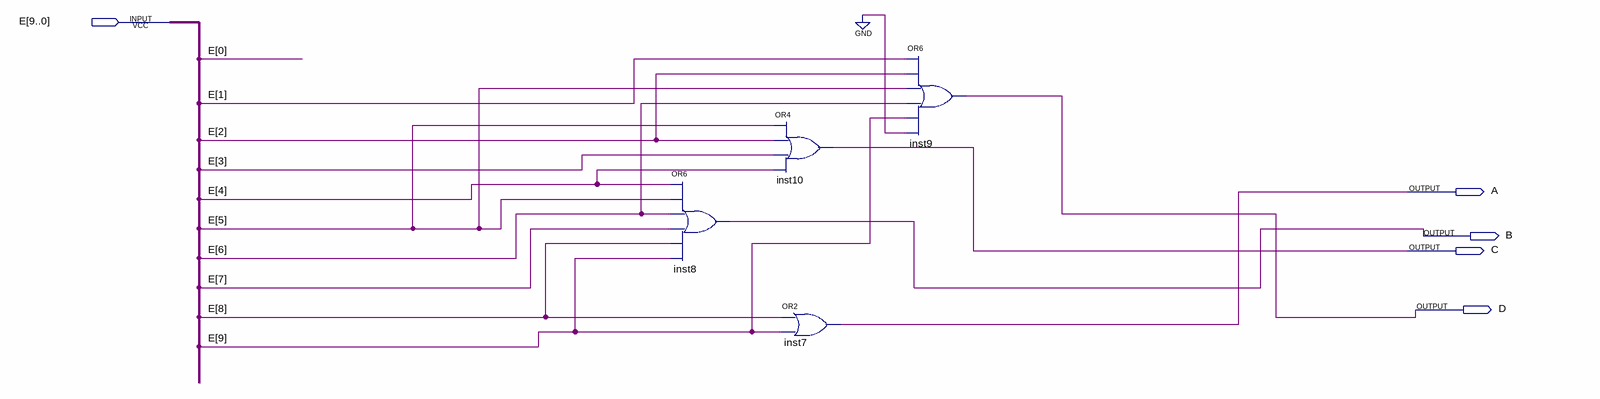
[diagram p0: schematic sheet]
// Quartus schematic Block4.bdf as structural Verilog: 4 symbols, 5 pins
module Block4 (
  input  [9:0] E,
  output A,
  output B,
  output C,
  output D
);

  or inst8 (B, E[4], E[5], E[6], E[7], E[8], E[9]);
  or inst10 (C, E[5], E[2], E[3], E[4]);
  or inst7 (A, E[8], E[9]);
  or inst9 (D, E[1], E[2], E[5], E[6], E[9], 1'b0);
endmodule
